# EAGLE design BPv4-PassiveLCD.v4 (EAGLE 5.11)
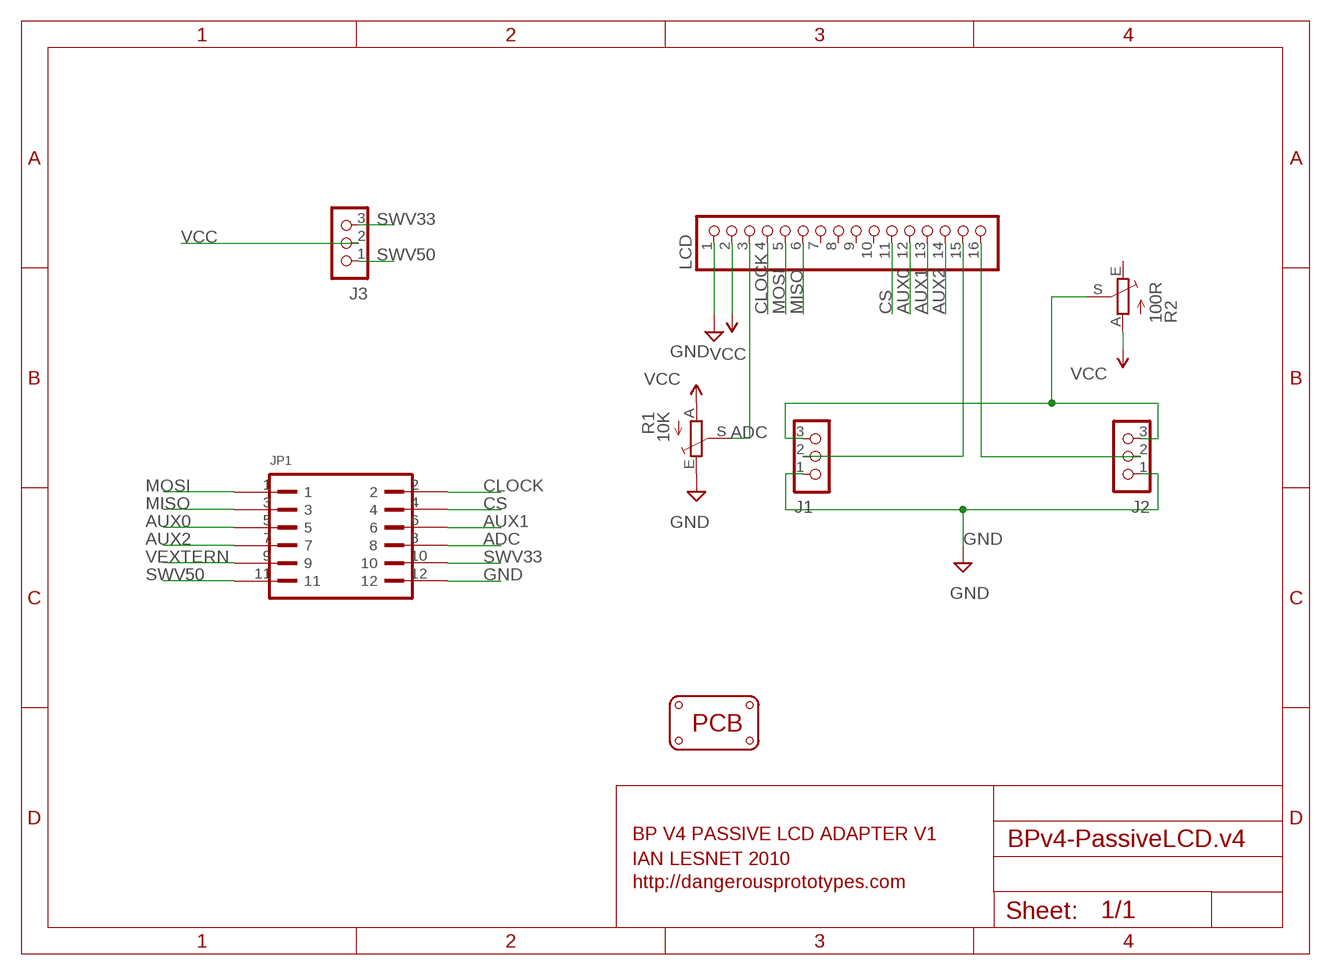
[diagram p0: schematic, sheet 1]

## Parts
J1  CON_HEADER_1X03-PTH  [M1X3]
J2  CON_HEADER_1X03-PTH  [M1X3]
J3  CON_HEADER_1X03-PTH  [M1X3]
JP1  PINSHRD-PTH-2X06  [PINSHRD_PTH_2X06]
LCD  PINHD-1X16  [1X16]
PCB1  PCB_DP_RECTANGLE-37X60  [DP6037_V1]
R1  10K  TRIM_EU-CA6V  [CA6V]
R2  100R  TRIM_EU-CA6V  [CA6V]

## Nets
A: J1.2 LCD.15
ADC: JP1.8 LCD.3 R1.S
AUX0: JP1.5 LCD.12
AUX1: JP1.6 LCD.13
AUX2: JP1.7 LCD.14
CLOCK: JP1.2 LCD.4
CS: JP1.4 LCD.11
GND: J1.1 J2.1 JP1.12 LCD.1 R1.E
K: J2.2 LCD.16
MISO: JP1.3 LCD.6
MOSI: JP1.1 LCD.5
N$2: J1.3 J2.3 R2.S
SWV33: J3.3 JP1.10
SWV50: J3.1 JP1.11
VCC: J3.2 LCD.2 R1.A R2.A
VEXTERN: JP1.9
Unconnected: LCD.7 LCD.8 LCD.9 LCD.10 R2.E

## Notes on the sheet
- BP V4 PASSIVE LCD ADAPTER V1
- IAN LESNET 2010
- http://dangerousprototypes.com

## Library data of the parts
J1-J3 = DP:CON_HEADER_1X03
JP1 = dp_devices:PINSHRD-PTH-2X06: Shrouded pin header, 2.54mm pitch
LCD = pinhead:PINHD-1X16: PIN HEADER
PCB1 = PCBStandards:PCB_DP_RECTANGLE: Dangerous Prototypes Standard Rectangular PCB sizes
R1 R2 = pot:TRIM_EU-: POTENTIOMETER

## Board
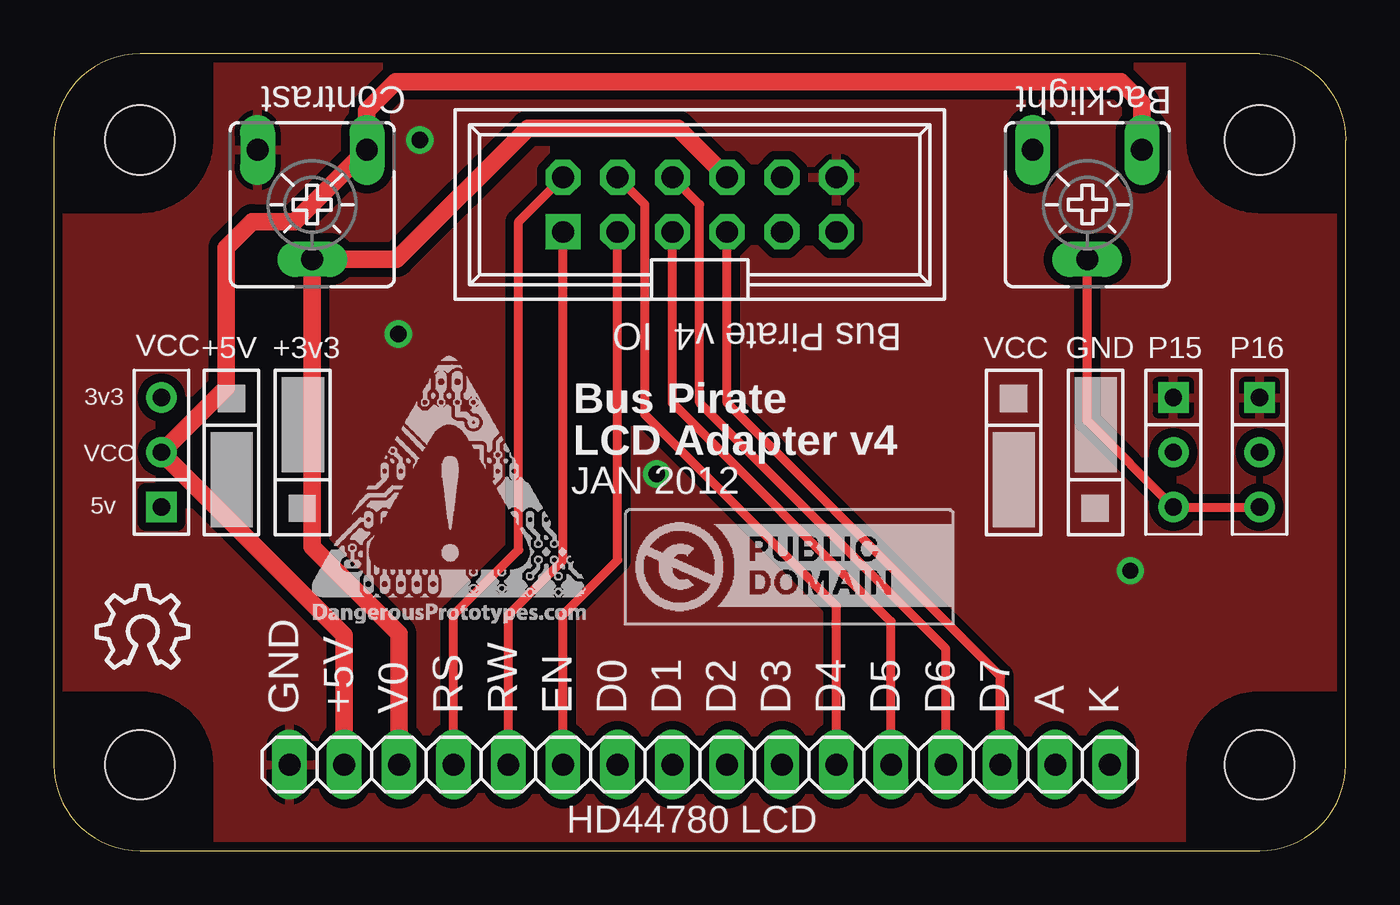
[diagram p1: board, top side]
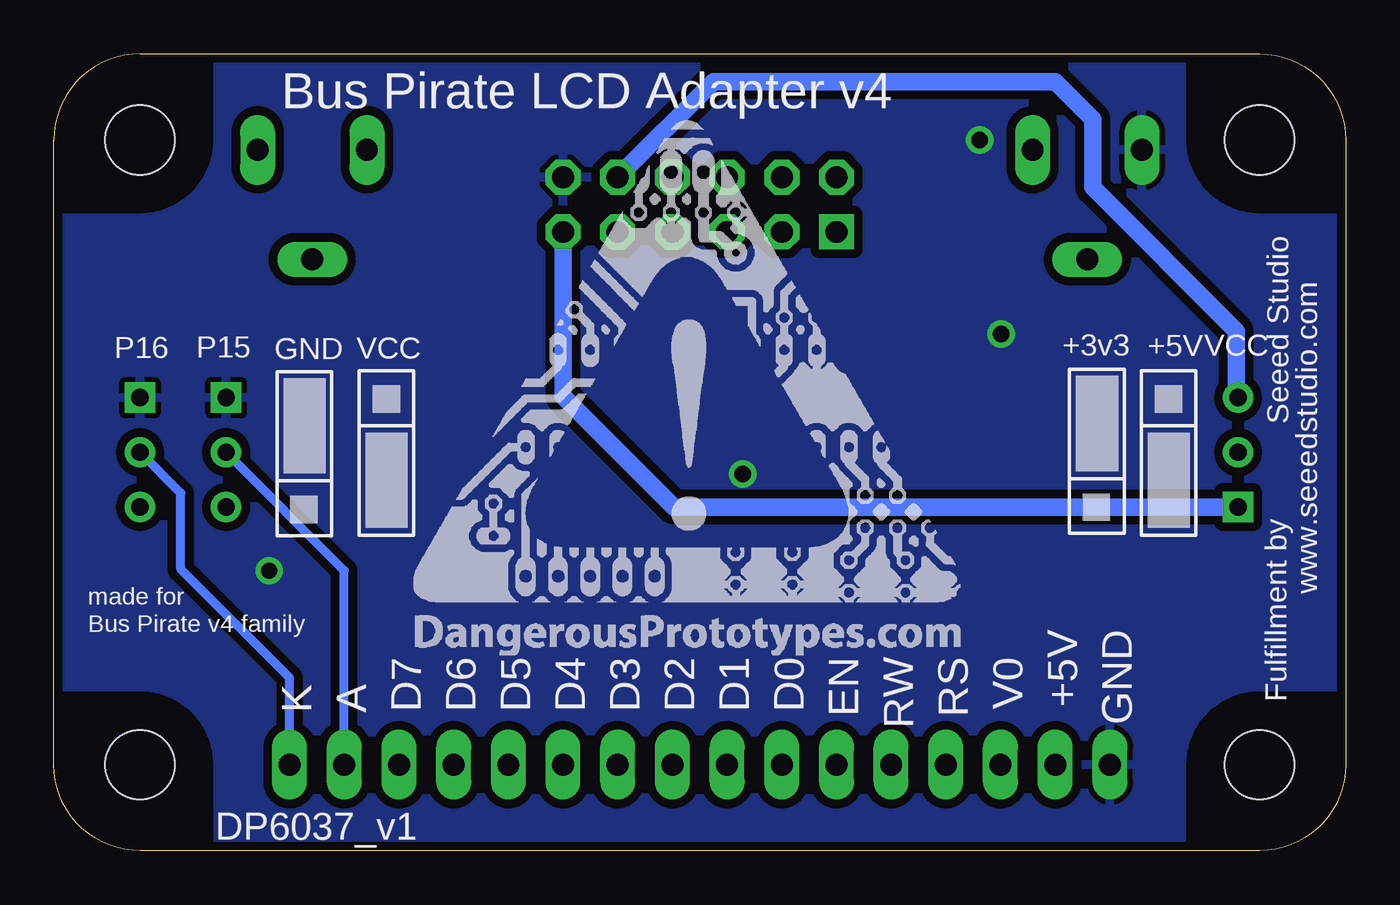
[diagram p2: board, bottom side, seen from below]

Size 60 x 37 mm. Coordinates in mm from the lower left corner, seen from the top.
Copper layers (1*16): Top 0.035mm / dielectric 1.5mm / Bottom 0.035mm
Design rules "SparkFun": minimum track width 8mil, minimum drill 20mil, track to track 8mil, track to pad 8mil, pad to pad 8mil, via to via 8mil, smd to smd 8mil, copper to edge 10mil, drill to drill 8mil, minimum pad ring 12mil, minimum via ring 10mil, stop-mask expansion 4mil, vias tented up to drill 25mil, thermal gap 10mil

### Footprints (pad centres in the part's own frame; a part is rotated, then mirrored left to right if it is on the bottom)
M1X3 = drill 0.8 square: 1 0,0 | drill 0.8 round: 2 2.54,0; 3 5.08,0
PINSHRD_PTH_2X06 = drill 1.016 square: 1 -6.35,-1.27 | drill 1.016 octagon: 2 -6.35,1.27; 3 -3.81,-1.27; 4 -3.81,1.27; 5 -1.27,-1.27; 6 -1.27,1.27; 7 1.27,-1.27; 8 1.27,1.27; 9 3.81,-1.27; 10 3.81,1.27; 11 6.35,-1.27; 12 6.35,1.27
1X16 = drill 1.016 long: 1 -19.05,0; 2 -16.51,0; 3 -13.97,0; 4 -11.43,0; 5 -8.89,0; 6 -6.35,0; 7 -3.81,0; 8 -1.27,0; 9 1.27,0; 10 3.81,0; 11 6.35,0; 12 8.89,0; 13 11.43,0; 14 13.97,0; 15 16.51,0; 16 19.05,0
DP6037_V1 = hole 3.2: 4,4; 56,4; 56,33; 4,33
CA6V = drill 1.016 long: A -2.54,-2.54; E 2.54,-2.54; S 0,2.54

### Placement (x,y rotation side)
J1  52,21.04 270 top
J2  56,21.04 270 top
J3  5,15.96 90 top
JP1  30,30 0 top
LCD  30,4 0 top
PCB1  0,0 0 top
R1  12,30 180 top
R2  48,30 180 top
U$1  [DP_LOGO_ART_0.5X0.5]  12.01,10.57 0 top
U$2  [DP_LOGO_ART_1X1]  43.28,9.09 0 bottom
U$3  [LOGO_CC-0]  26.5,10.5 0 top
U$4  [OSHW_8X150_NOTEXT]  2,8.5 0 top

### Tracks (layer width: path | path; a pad name or v marks a point on that pad's centre or on a via)
A
  Bottom 0.406: J1.2 46.51,13.01 LCD.15
ADC
  Top 0.813: LCD.3 16.03,10.08 12,14.11 R1.S 15.93,27.46 22.02,33.55 28.99,33.55 JP1.8
AUX0
  Top 0.406: JP1.5 28.73,20.8 38.89,10.64 LCD.12
AUX1
  Top 0.406: JP1.6 30,30 30,20.8 41.43,9.37 LCD.13
AUX2
  Top 0.406: JP1.7 31.27,20.8 43.97,8.1 LCD.14
CLOCK
  Top 0.406: JP1.2 21.59,29.21 21.59,13.97 18.57,10.95 LCD.4
CS
  Top 0.406: JP1.4 27.46,30 27.46,20.24 36.35,11.35 LCD.11
GND  (via drill 0.76)
  other vias: 16,24 28,17.5 50,13 17,33
  pour Bottom (isolate 0.406): 0,37 60,37 60,0 0,0
  pour Top (isolate 0.406): 0,37 60,37 60,0 -0.5,0
K
  Bottom 0.406: J2.2 54.1,16.6 54.1,13.08 49.05,8.03 LCD.16
MISO
  Top 0.406: JP1.3 26.19,13.49 23.65,10.95 LCD.6
MOSI
  Top 0.406: JP1.1 23.65,13.49 21.11,10.95 LCD.5
N$2
  Top 0.406: J2.3 J1.3 48,19.96 R2.S
SWV33
  Bottom 0.813: JP1.10 29.37,35.71 13.49,35.71 11.75,33.97 11.75,30.8 5.08,24.13 5.08,21.12 J3.3
SWV50
  Bottom 0.813: JP1.11 36.35,21.11 31.2,15.96 J3.1
VCC
  Top 0.813: R2.A 50.54,34.73 49.55,35.71 15.88,35.71 14.53,34.37 14.53,32.55 | 14.53,32.55 R1.A | 14.53,32.55 11.19,29.21 9.21,29.21 8,28 8,21.5 J3.2 13.49,10 LCD.2

### Text on the board
tNames: Contrast | Backlight | Bus Pirate v4 IO | VCC | +5V | +3v3 | VCC | GND | P15 | P16 | 3v3 | Bus Pirate | VCC | LCD Adapter v4 | JAN 2012 | 5v | GND | +5V | V0 | RS | RW | EN | D0 | D1 | D2 | D3 | D4 | D5 | D6 | D7 | A | K | HD44780 LCD
bNames: Bus Pirate LCD Adapter v4 | www.seeedstudio.com | VCC | +5V | +3v3 | VCC | GND | P15 | P16 | Seeed Studio | made for | GND | +5V | Bus Pirate v4 family | V0 | RS | RW | EN | D0 | D1 | D2 | D3 | D4 | D5 | D6 | D7 | A | K | Fulfillment by